# Altium schematic sheet SWD.SchDoc
size A4; SheetNumber: 8; SheetTotal: 11
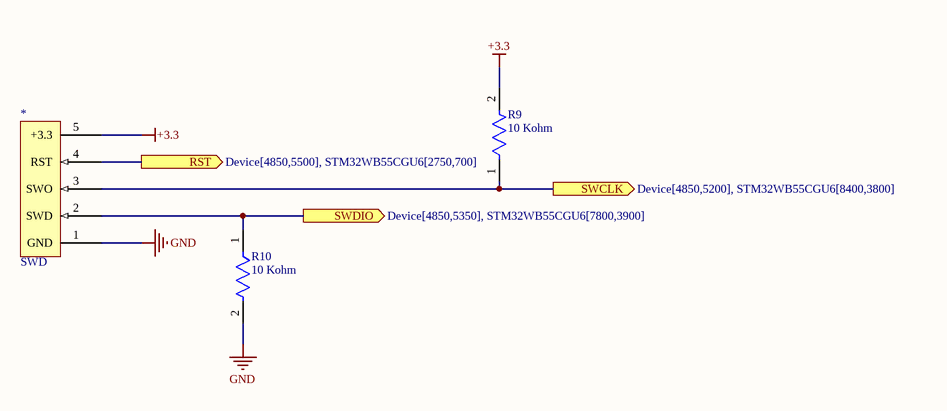
[diagram p0: SWD.SchDoc]

## Parts
*  SWD  [PCBComponent_1]
R9  10 Kohm  [FP-RC1005-IPC_C]
R10  10 Kohm  [FP-RC1005-IPC_C]

## Ports
RST (out, see Device[4850,5500], STM32WB55CGU6[2750,700]), SWCLK (out, see Device[4850,5200], STM32WB55CGU6[8400,3800]), SWDIO (out, see Device[4850,5350], STM32WB55CGU6[7800,3900])

## Nets
+3.3: *.5(+3.3) R9.2
GND: *.1(GND) R10.2
RST: *.4(RST) ; port RST
SWCLK: *.3(SWO) R9.1 ; port SWCLK
SWDIO: *.2(SWD) R10.1 ; port SWDIO

## Library data of the parts
* = SWD: pin to pad: 4>5 5>4
R9 R10 = CMP-13261-000953-1: Res Thick Film 0402 1.87kΩ 1% 0.063W ±100ppm/°C Molded SMD T/R; Power Rating: 63mW; Voltage Rating (DC): 50V; Resistance: 1.87kR; Tolerance: 1%; Height: 0.016inch; Length: 1mm; Case Code (Metric): 1005; Width: 0.02inch; Max Power Dissipation: 63mW; Radiation Hardening: No; Features: Moisture Resistant; Temperature Coefficient: 100ppm/°C; Min Operating Temperature: -55°C; Number of Terminations: 2; Max Operating Temperature: 155°C; Case Code (Imperial): 0402; Composition: Thick Film; Depth: 0.5mm; Lead Free: Lead Free; Package Quantity: 1; Case/Package: 0402; Packaging: Tape and Reel; Contact Plating: Tin; Military Standard: Not